# Altium schematic sheet top.SchDoc
size A
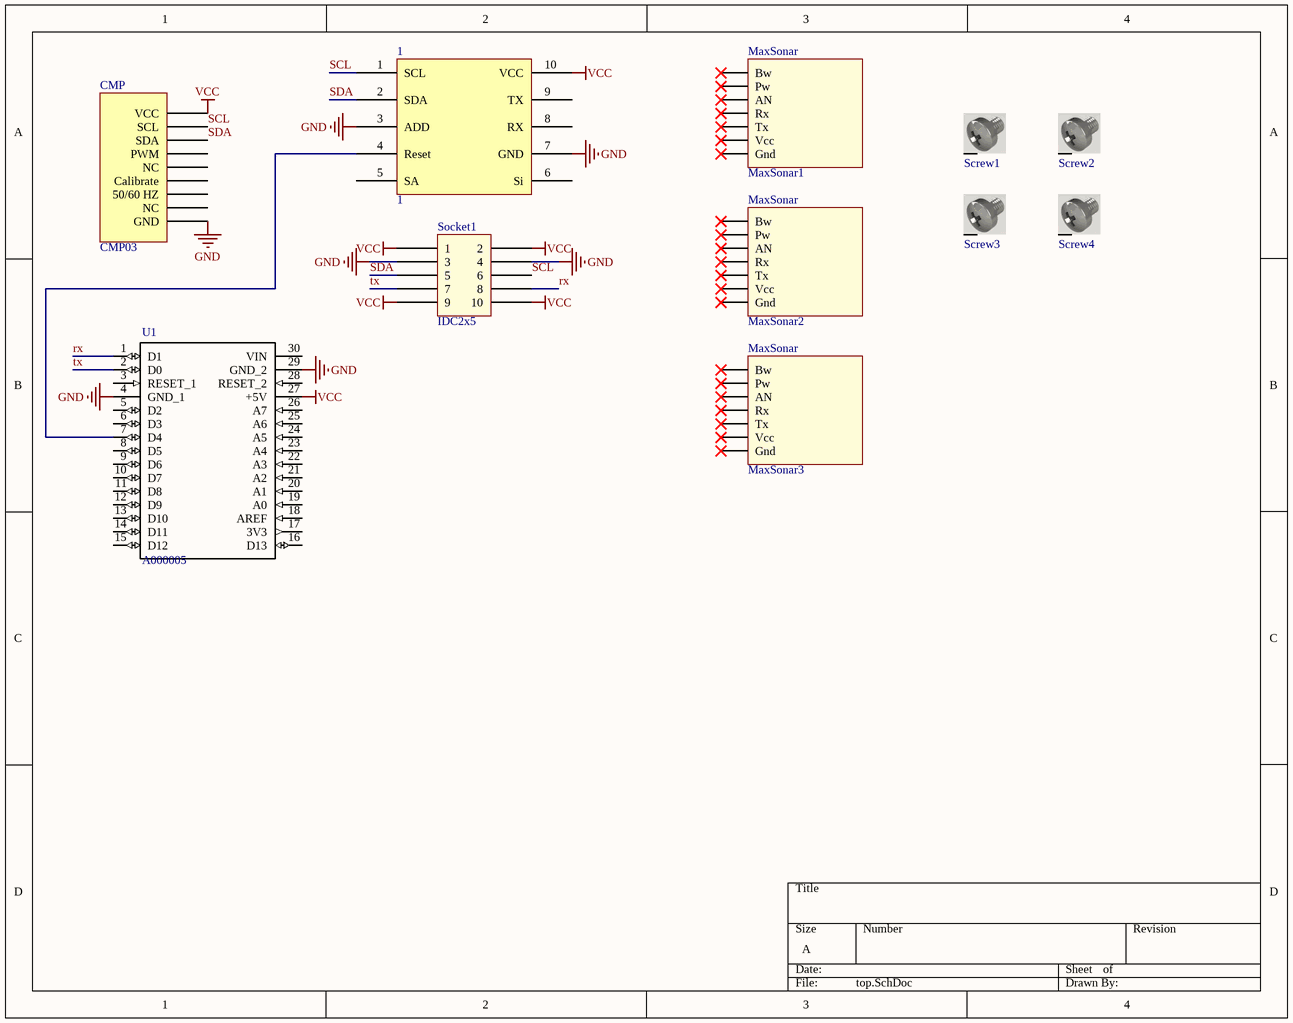
[diagram p0: top.SchDoc]

## Parts
1  1  [DIP10]
CMP  CMP03  [CMP03]
MaxSonar1  Ultrasonic  [MaxSonar]  (value not drawn)
MaxSonar2  Ultrasonic  [MaxSonar]  (value not drawn)
MaxSonar3  Ultrasonic  [MaxSonar]  (value not drawn)
Screw1  Screw  [Screw]  (value not drawn)
Screw2  Screw  [Screw]  (value not drawn)
Screw3  Screw  [Screw]  (value not drawn)
Screw4  Screw  [Screw]  (value not drawn)
Socket1  IDC2x5  [IDC 2x5]
U1  A000005  [ARDUINO_A000005]

## Nets
GND: 1.3(ADD) 1.7(GND) CMP.9(GND) Socket1.3 Socket1.4 U1.4(GND_1) U1.29(GND_2)
VCC: 1.10(VCC) CMP.1(VCC) Socket1.1 Socket1.2 Socket1.9 Socket1.10 U1.27(+5V)
rx: Socket1.8 U1.1(D1)
SCL: 1.1(SCL) CMP.2(SCL) Socket1.6
SDA: 1.2(SDA) CMP.3(SDA) Socket1.5
tx: Socket1.7 U1.2(D0)
Net1_4: 1.4(Reset) U1.7(D4)

Not connected (* = marked no-connect by the designer): 1 5(SA) 6(Si) 8(RX) 9(TX); CMP 4(PWM) 5(NC) 6(Calibrate) 7(50/60_HZ) 8(NC); MaxSonar1 1(Bw)* 2(Pw)* 3(AN)* 4(Rx)* 5(Tx)* 6(Vcc)* 7(Gnd)*; MaxSonar2 1(Bw)* 2(Pw)* 3(AN)* 4(Rx)* 5(Tx)* 6(Vcc)* 7(Gnd)*; MaxSonar3 1(Bw)* 2(Pw)* 3(AN)* 4(Rx)* 5(Tx)* 6(Vcc)* 7(Gnd)*; Screw1 S; Screw2 S; Screw3 S; Screw4 S; U1 3(RESET_1) 5(D2) 6(D3) 8(D5) 9(D6) 10(D7) 11(D8) 12(D9) 13(D10) 14(D11) 15(D12) 16(D13) 17(3V3) 18(AREF) 19(A0) 20(A1) 21(A2) 22(A3) 23(A4) 24(A5) 25(A6) 26(A7) 28(RESET_2) 30(VIN)

## Library data of the parts
1 = Component_1
MaxSonar1-MaxSonar3 = MaxSonar
Socket1 = IDC 2x5
U1 = Nano: MICRO, ARDUINO NANO 3.0, MINI-B USB, ATmega328, 0.1DIP, ICSP HDR; MP: A000005; Package: None; Availability: Unavailable; Price: None; SnapEDA_Link: https://www.snapeda.com/parts/A000005/Arduino/view-part/?ref=snap; MF: Arduino; Value: *
Screw1-Screw4 = Screw: LatestRevisionDate: 17-Jul-2002; LatestRevisionNote: Re-released for DXP Platform.; Publisher: Altium Limited